# EAGLE design storage board (EAGLE 6.4)

## Sheet 1 of 2
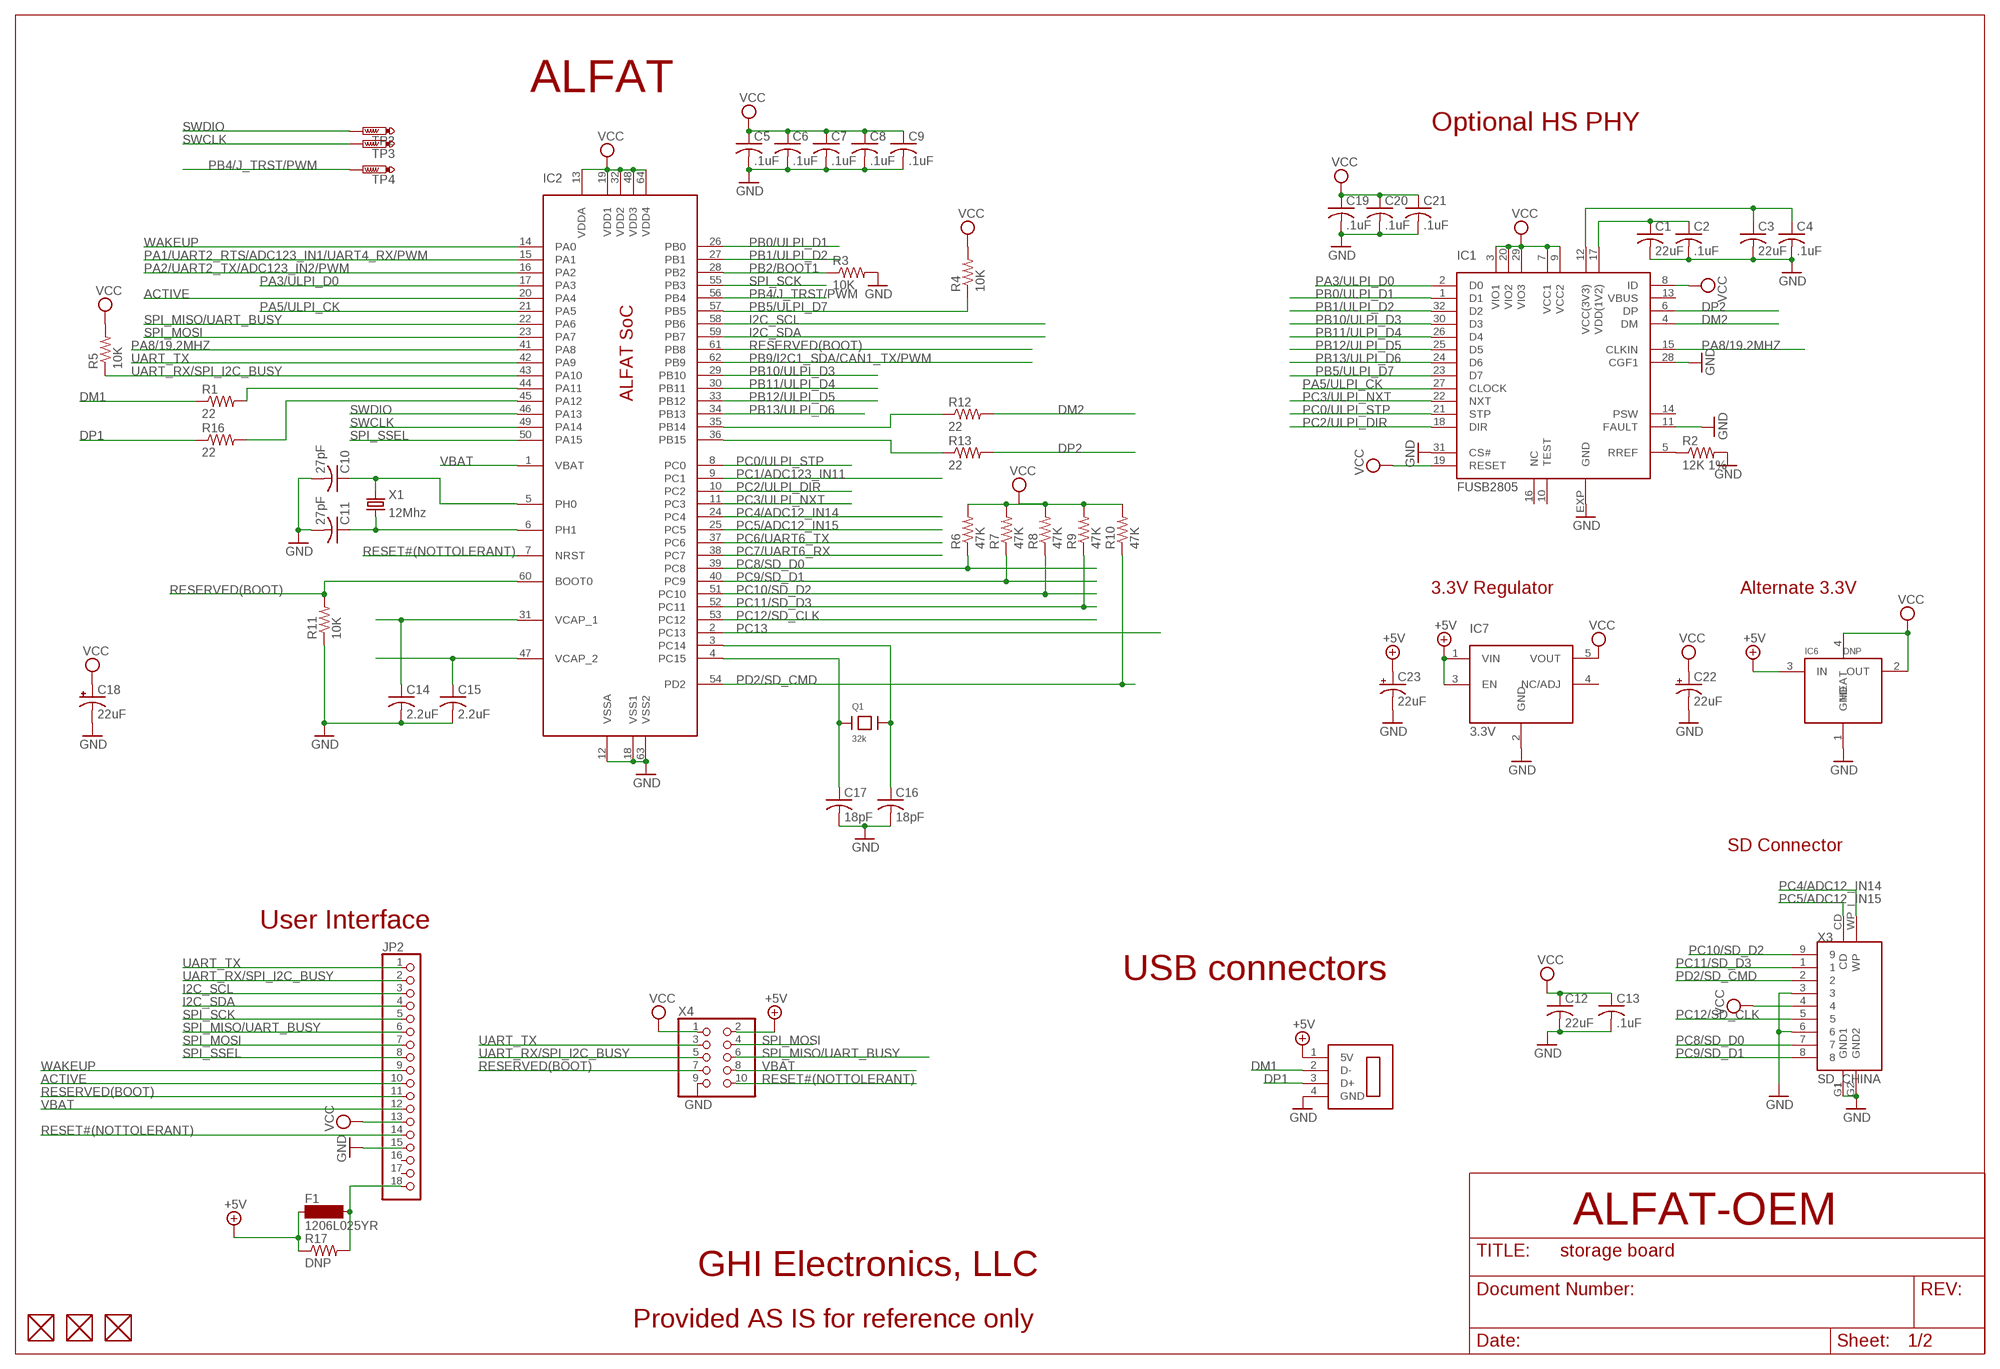
[diagram p0: schematic, sheet 1]

### Parts
C1  22uF  C-USC0805K  [C0805K]
C2  .1uF  C-USC0603K  [C0603K]
C3  22uF  C-USC0805K  [C0805K]
C4  .1uF  C-USC0603K  [C0603K]
C5  .1uF  C-USC0603K  [C0603K]
C6  .1uF  C-USC0603K  [C0603K]
C7  .1uF  C-USC0603K  [C0603K]
C8  .1uF  C-USC0603K  [C0603K]
C9  .1uF  C-USC0603K  [C0603K]
C10  27pF  C-USC0603K  [C0603K]
C11  27pF  C-USC0603K  [C0603K]
C12  22uF  C-USC0805K  [C0805K]
C13  .1uF  C-USC0603K  [C0603K]
C14  2.2uF  C-USC0805K  [C0805K]
C15  2.2uF  C-USC0805K  [C0805K]
C16  18pF  C-USC0603K  [C0603K]
C17  18pF  C-USC0603K  [C0603K]
C18  22uF  CPOL-USCT3528  [CT3528]
C19  .1uF  C-USC0603K  [C0603K]
C20  .1uF  C-USC0603K  [C0603K]
C21  .1uF  C-USC0603K  [C0603K]
C22  22uF  CPOL-USCT3528  [CT3528]
C23  22uF  CPOL-USCT3528  [CT3528]
F1  1206L025YR  SM-1206  [SM-1206]
FUD1  FIDUCIAL  [FIDUCIAL_40MIL]
FUD2  FIDUCIAL  [FIDUCIAL_40MIL]
FUD3  FIDUCIAL  [FIDUCIAL_40MIL]
IC1  FUSB2805  [MLP32]
IC2  STM32F40X  [LQFP64]
IC6  DNP  LD1117SOT89  [SOT89]
IC7  3.3V  5PIN_REG  [SOT23-5]
JP2  PINHD-1X18  [1X18]
Q1  32k  CRYSTAL_3.2X1.5  [CRYSTAL_3.2X1.5]
R1  22  R-US_R0603  [R0603]
R2  12K 1%  R-US_R0603  [R0603]
R3  10K  R-US_R0603  [R0603]
R4  10K  R-US_R0603  [R0603]
R5  10K  R-US_R0603  [R0603]
R6  47K  R-US_R0603  [R0603]
R7  47K  R-US_R0603  [R0603]
R8  47K  R-US_R0603  [R0603]
R9  47K  R-US_R0603  [R0603]
R10  47K  R-US_R0603  [R0603]
R11  10K  R-US_R0603  [R0603]
R12  22  R-US_R0603  [R0603]
R13  22  R-US_R0603  [R0603]
R16  22  R-US_R0603  [R0603]
R17  DNP  R-US_R0603  [R0603]
TP2  PTR1B1,27  [B1,27]
TP3  PTR1B1,27  [B1,27]
TP4  PTR1B1,27  [B1,27]
X1  12Mhz  CRYTALSM49  [SM49@1]
X2  USB_HOST_CON  [USB_HOST_CON]
X3  SD_CHINA  [SD_CHINA]
X4  PINHD-2X5  [2X05]

### Nets
+5V [power]: C23.+ F1.1 IC6.3(IN) IC7.1(VIN) IC7.3(EN) R17.1 X2.1(5V) X4.2
ACTIVE: IC2.20(PA4) JP2.10
DM1: R1.1 X2.2(D-)
DM2: IC1.4(DM) R12.2
DP1: R16.1 X2.3(D+)
DP2: IC1.6(DP) R13.2
GND [power]: C1.2 C2.2 C3.2 C4.2 C5.2 C6.2 C7.2 C8.2 C9.2 C10.2 C11.2 C12.2 C13.2 C14.2 C15.2 C16.2 C17.2 C18.- C19.2 C20.2 C21.2 C22.- C23.- IC1.11(FAULT) IC1.28(CGF1) IC1.31(CS#) IC1.EXP(GND) IC2.12(VSSA) IC2.18(VSS1) IC2.63(VSS2) IC6.1(GND) IC7.2(GND) JP2.15 R2.2 R3.2 R11.1 X2.4(GND) X3.3 X3.6 X3.G1(GND1) X3.G2(GND2) X4.9
I2C_SCL: IC2.58(PB6) JP2.3
I2C_SDA: IC2.59(PB7) JP2.4
N$9: C15.1 IC2.47(VCAP_2)
N$10: C14.1 IC2.31(VCAP_1)
N$12: IC1.5(RREF) R2.1
N$13: IC2.44(PA11) R1.2
N$14: C1.1 C2.1 IC1.17(VDD(1V2))
N$15: C3.1 C4.1 IC1.12(VCC(3V3))
N$16: IC2.45(PA12) R16.2
N$18: IC2.35(PB14) R12.1
N$19: IC2.36(PB15) R13.1
N$21 [power]: F1.2 JP2.18 R17.2
PA1/UART2_RTS/ADC123_IN1/UART4_RX/PWM: IC2.15(PA1)
PA2/UART2_TX/ADC123_IN2/PWM: IC2.16(PA2)
PA3/ULPI_D0: IC1.2(D0) IC2.17(PA3)
PA5/ULPI_CK: IC1.27(CLOCK) IC2.21(PA5)
PA8/19.2MHZ: IC1.15(CLKIN) IC2.41(PA8)
PB0/ULPI_D1: IC1.1(D1) IC2.26(PB0)
PB1/ULPI_D2: IC1.32(D2) IC2.27(PB1)
PB2/BOOT1: IC2.28(PB2) R3.1
PB4/J_TRST/PWM: IC2.56(PB4) TP4.PP(TP)
PB5/ULPI_D7: IC1.23(D7) IC2.57(PB5) R4.1
PB9/I2C1_SDA/CAN1_TX/PWM: IC2.62(PB9)
PB10/ULPI_D3: IC1.30(D3) IC2.29(PB10)
PB11/ULPI_D4: IC1.26(D4) IC2.30(PB11)
PB12/ULPI_D5: IC1.25(D5) IC2.33(PB12)
PB13/ULPI_D6: IC1.24(D6) IC2.34(PB13)
PC0/ULPI_STP: IC1.21(STP) IC2.8(PC0)
PC1/ADC123_IN11: IC2.9(PC1)
PC2/ULPI_DIR: IC1.18(DIR) IC2.10(PC2)
PC3/ULPI_NXT: IC1.22(NXT) IC2.11(PC3)
PC4/ADC12_IN14: IC2.24(PC4) X3.WP
PC5/ADC12_IN15: IC2.25(PC5) X3.CD
PC6/UART6_TX: IC2.37(PC6)
PC7/UART6_RX: IC2.38(PC7)
PC8/SD_D0: IC2.39(PC8) R6.1 X3.7
PC9/SD_D1: IC2.40(PC9) R7.1 X3.8
PC10/SD_D2: IC2.51(PC10) R8.1 X3.9
PC11/SD_D3: IC2.52(PC11) R9.1 X3.1
PC12/SD_CLK: IC2.53(PC12) X3.5
PC13: IC2.2(PC13)
PD2/SD_CMD: IC2.54(PD2) R10.1 X3.2
RESERVED(BOOT): IC2.60(BOOT0) IC2.61(PB8) JP2.11 R11.2 X4.7
RESET#(NOTTOLERANT): IC2.7(NRST) JP2.14 X4.10
SPI_MISO/UART_BUSY: IC2.22(PA6) JP2.6 X4.6
SPI_MOSI: IC2.23(PA7) JP2.7 X4.4
SPI_SCK: IC2.55(PB3) JP2.5
SPI_SSEL: IC2.50(PA15) JP2.8
SWCLK: IC2.49(PA14) TP3.PP(TP)
SWDIO: IC2.46(PA13) TP2.PP(TP)
UART_RX/SPI_I2C_BUSY: IC2.43(PA10) JP2.2 R5.1 X4.5
UART_TX: IC2.42(PA9) JP2.1 X4.3
VBAT: IC2.1(VBAT) JP2.12 X4.8
VCC [power]: C5.1 C6.1 C7.1 C8.1 C9.1 C12.1 C13.1 C18.+ C19.1 C20.1 C21.1 C22.+ IC1.3(VIO1) IC1.7(VCC1) IC1.8(ID) IC1.9(VCC2) IC1.19(RESET) IC1.20(VIO2) IC1.29(VIO3) IC2.13(VDDA) IC2.19(VDD1) IC2.32(VDD2) IC2.48(VDD3) IC2.64(VDD4) IC6.2(OUT) IC6.4(HEAT) IC7.5(VOUT) JP2.13 R4.2 R5.2 R6.2 R7.2 R8.2 R9.2 R10.2 X3.4 X4.1
WAKEUP: IC2.14(PA0) JP2.9
XI32: C17.1 IC2.4(PC15) Q1.P$1
XO32: C16.1 IC2.3(PC14) Q1.P$2
XTAL3: C10.1 IC2.5(PH0) X1.2
XTAL4: C11.1 IC2.6(PH1) X1.1
Unconnected: FUD1.P$1 FUD2.P$1 FUD3.P$1 IC1.10(TEST) IC1.13(VBUS) IC1.14(PSW) IC1.16(NC) IC7.4(NC/ADJ) JP2.16 JP2.17 X2.5(5V) X2.6(D-) X2.7(D+)

### Notes on the sheet
- ALFAT
- Optional HS PHY
- ALFAT SoC
- 3.3V Regulator | Alternate 3.3V
- SD Connector
- User Interface
- USB connectors
- ALFAT-OEM
- GHI Electronics, LLC
- Provided AS IS for reference only

## Sheet 2 of 2
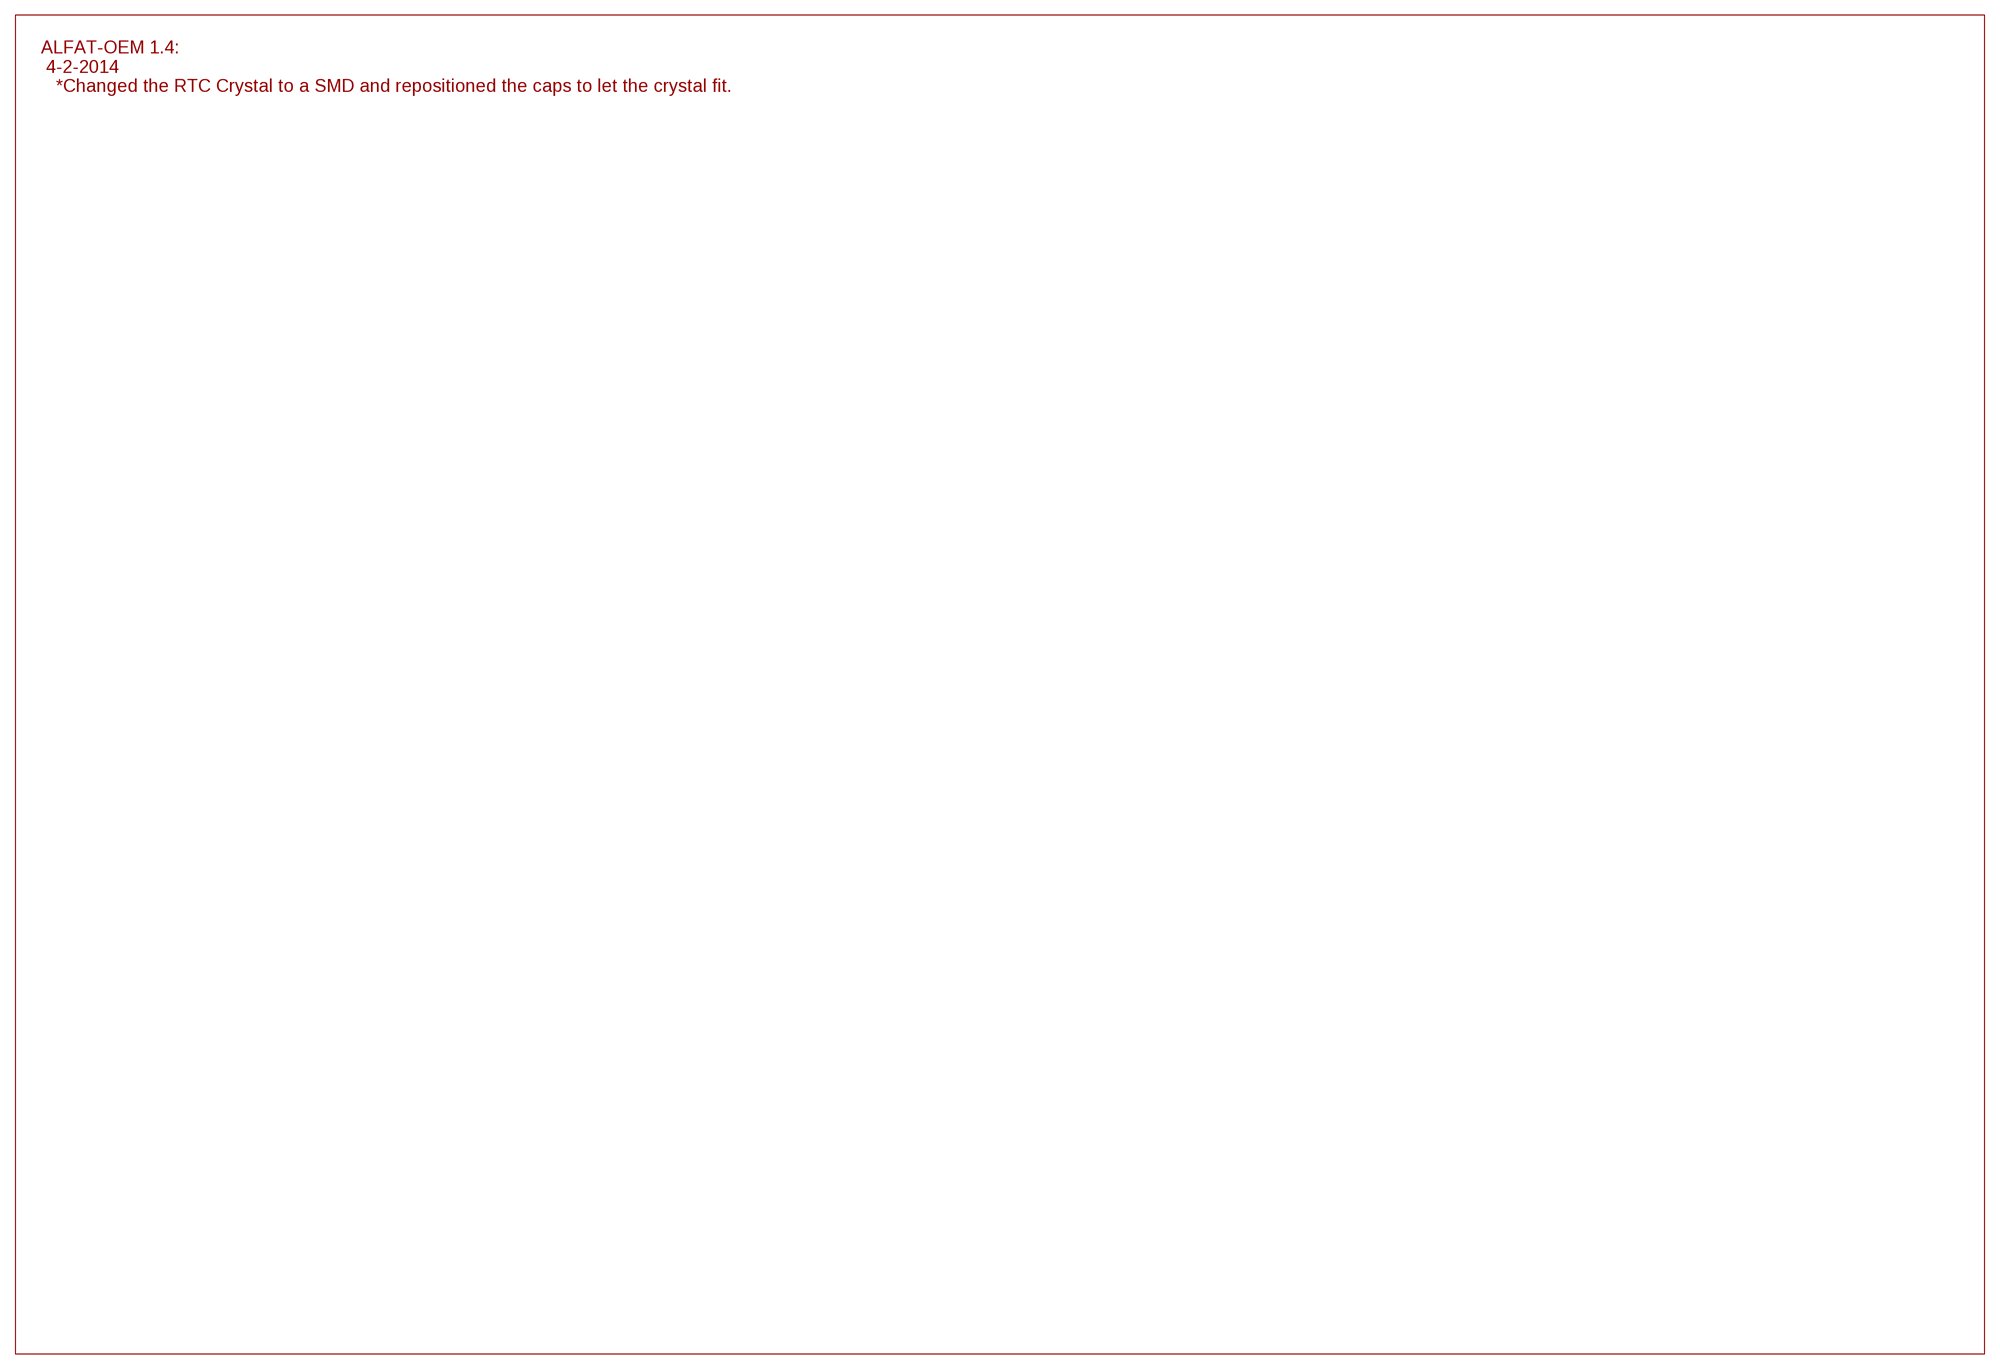
[diagram p1: schematic, sheet 2]

### Notes on the sheet
- ALFAT-OEM 1.4:
   4-2-2014
     *Changed the RTC Crystal to a SMD and repositioned the caps to let the crystal fit.

## Power pins joined to a net without a drawn wire
GND: X2.8(GND)

## Library data of the parts
C1-C17 C19-C21 = rcl:C-US: CAPACITOR, American symbol
C18 C22 C23 = rcl:CPOL-US: POLARIZED CAPACITOR, American symbol
F1 = inductor-neosid:SM-1206: INDUCTOR SMD chip inductor
FUD1-FUD3 = GHI:FIDUCIAL
IC1 = GHI:FUSB2805
IC2 = GHI:STM32F40X
IC6 = ICs_v54:LD1117
IC7 = GHI:5PIN_REG
JP2 = pinhead:PINHD-1X18: PIN HEADER
Q1 = GHI:CRYSTAL_3.2X1.5
R1-R13 R16 R17 = rcl:R-US_: RESISTOR, American symbol
TP2-TP4 = testpad:PTR1: TEST PIN
X1 = crystal:CRYTAL: CRYSTAL
X2 = GHI:USB_HOST_CON
X3 = GHI:SD_CHINA
X4 = pinhead:PINHD-2X5: PIN HEADER

## Board
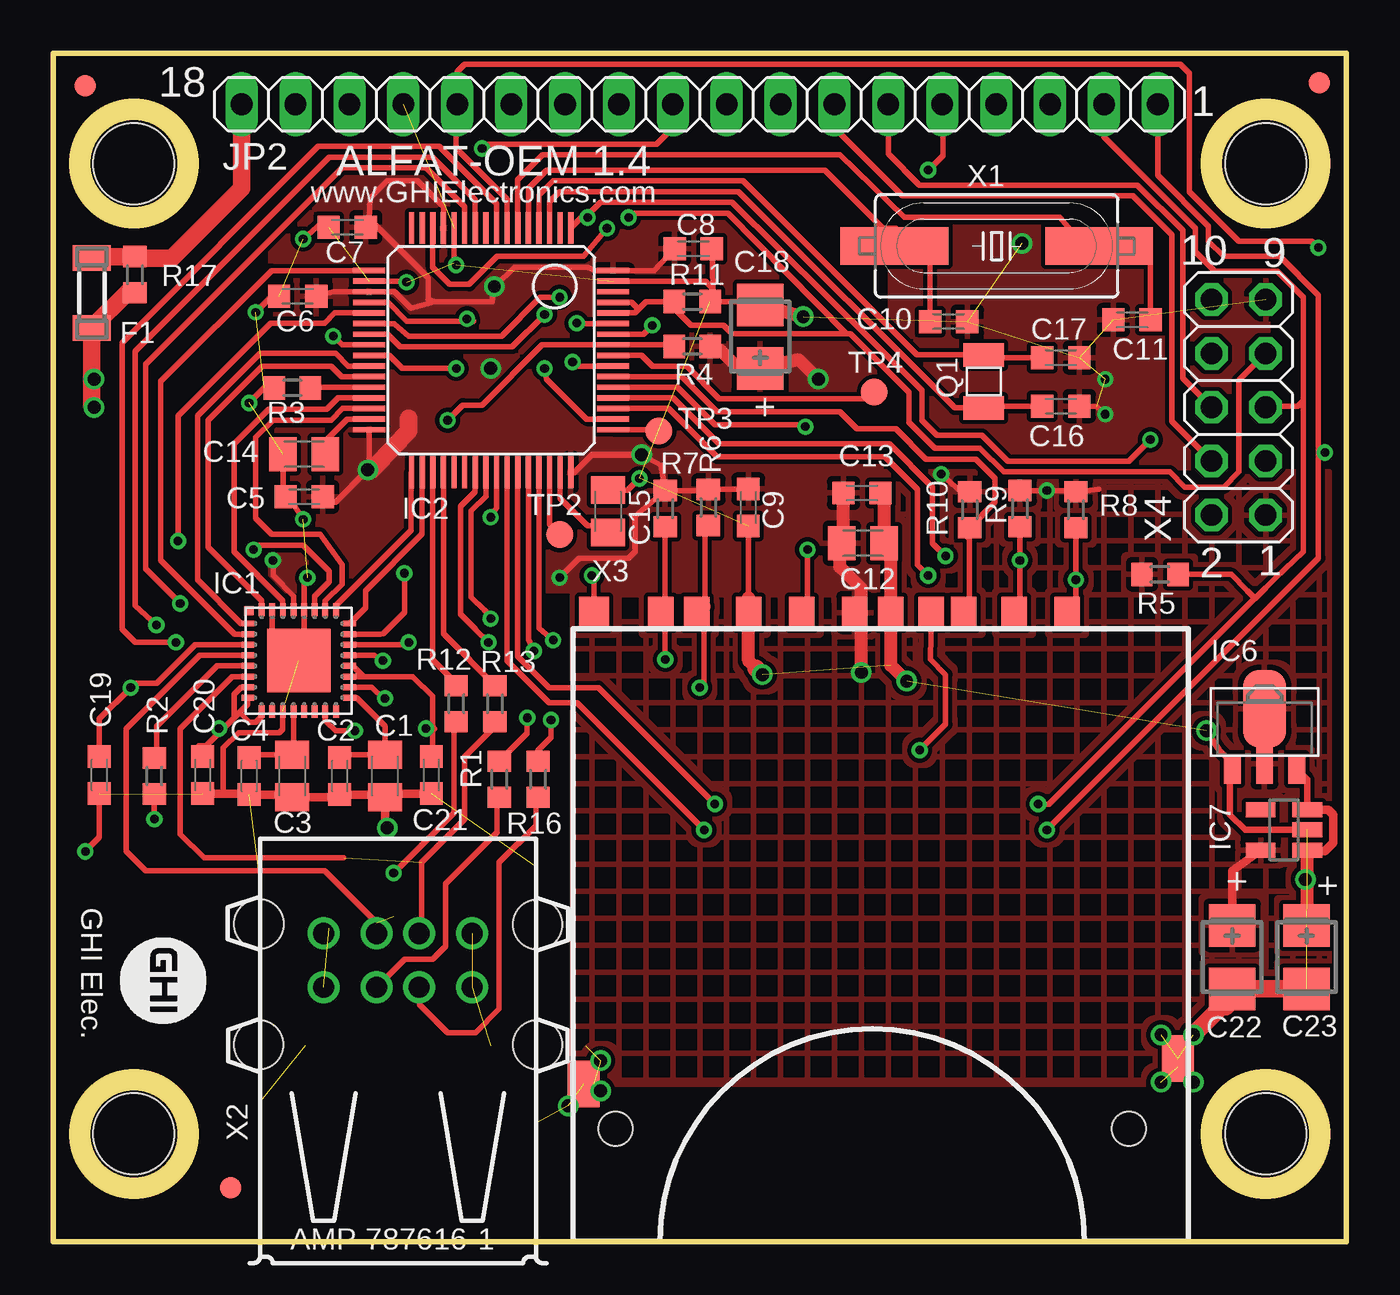
[diagram p2: board, top side]
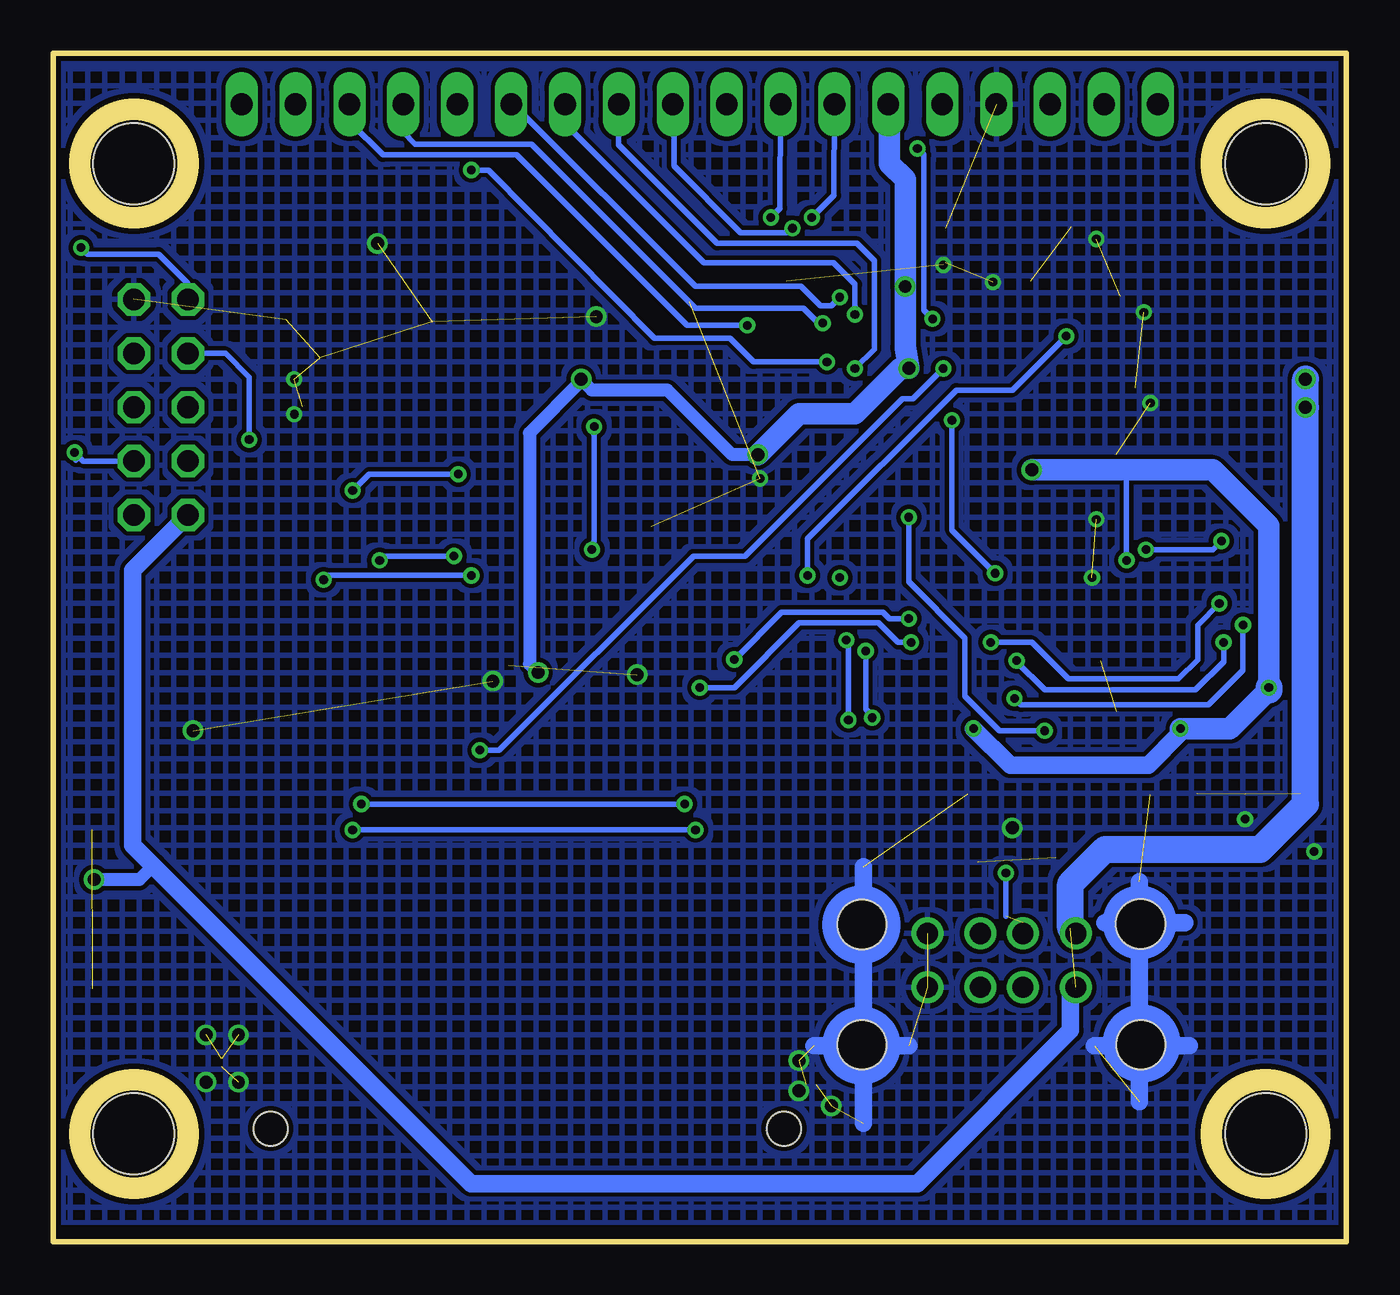
[diagram p3: board, bottom side, seen from below]

Size 60.96 x 56.01 mm. Coordinates in mm from the lower left corner, seen from the top.
Outline: 0,0 60.96,0 60.96,56.01 0,56.01 0,0
Outline: circle at 3.81,5.08 radius 2.54
Outline: circle at 57.15,5.08 radius 2.54
Outline: circle at 57.15,50.8 radius 2.54
Outline: circle at 3.81,50.8 radius 2.54
Copper layers (1*16): Top 0.035mm / dielectric 1.5mm / Bottom 0.035mm
Design rules "default": minimum track width 8mil, minimum drill 12mil, track to track 8mil, track to pad 8mil, pad to pad 8mil, via to via 8mil, smd to smd 8mil, copper to edge 10mil, drill to drill 8mil, minimum pad ring 10mil, minimum via ring 7mil, stop-mask expansion 4mil, vias tented up to drill 30mil, thermal gap 10mil
Holes 3.81 mm at 3.81,5.08 3.81,50.8 57.15,50.8 57.15,5.08

### Footprints (pad centres in the part's own frame; a part is rotated, then mirrored left to right if it is on the bottom)
C0805K = smd 1.3 x 1.6: 1 -1,0; 2 1,0
C0603K = smd 1.05 x 1.08: 1 -0.875,0; 2 0.875,0
CT3528 = smd 2 x 2.2: + -1.5,0; - 1.5,0
SM-1206 = smd 1.2 x 1.8: 1 -1.65,0; 2 1.65,0
FIDUCIAL_40MIL = smd 1.016 x 1.016: P$1 0,0
MLP32 = smd 0.6 x 0.28: 1 -2.4,1.75; 2 -2.4,1.25; 3 -2.4,0.75; 4 -2.4,0.25; 5 -2.4,-0.25; 6 -2.4,-0.75; 7 -2.4,-1.25; 8 -2.4,-1.75; 17 2.4,-1.75; 18 2.4,-1.25; 19 2.4,-0.75; 20 2.4,-0.25; 21 2.4,0.25; 22 2.4,0.75; 23 2.4,1.25; 24 2.4,1.75 | smd 0.28 x 0.6: 9 -1.75,-2.4; 10 -1.25,-2.4; 11 -0.75,-2.4; 12 -0.25,-2.4; 13 0.25,-2.4; 14 0.75,-2.4; 15 1.25,-2.4; 16 1.75,-2.4; 25 1.75,2.4; 26 1.25,2.4; 27 0.75,2.4; 28 0.25,2.4; 29 -0.25,2.4; 30 -0.75,2.4; 31 -1.25,2.4; 32 -1.75,2.4 | smd 3 x 3: EXP 0,0 | smd 0.435 x 0.435: M -2.353,2.353
LQFP64 = smd 0.25 x 1.5: 1 -3.75,-5.75; 2 -3.25,-5.75; 3 -2.75,-5.75; 4 -2.25,-5.75; 5 -1.75,-5.75; 6 -1.25,-5.75; 7 -0.75,-5.75; 8 -0.25,-5.75; 9 0.25,-5.75; 10 0.75,-5.75; 11 1.25,-5.75; 12 1.75,-5.75; 13 2.25,-5.75; 14 2.75,-5.75; 15 3.25,-5.75; 16 3.75,-5.75; 33 3.75,5.75; 34 3.25,5.75; 35 2.75,5.75; 36 2.25,5.75; 37 1.75,5.75; 38 1.25,5.75; 39 0.75,5.75; 40 0.25,5.75; 41 -0.25,5.75; 42 -0.75,5.75; 43 -1.25,5.75; 44 -1.75,5.75; 45 -2.25,5.75; 46 -2.75,5.75; 47 -3.25,5.75; 48 -3.75,5.75 | smd 1.5 x 0.25: 17 5.75,-3.75; 18 5.75,-3.25; 19 5.75,-2.75; 20 5.75,-2.25; 21 5.75,-1.75; 22 5.75,-1.25; 23 5.75,-0.75; 24 5.75,-0.25; 25 5.75,0.25; 26 5.75,0.75; 27 5.75,1.25; 28 5.75,1.75; 29 5.75,2.25; 30 5.75,2.75; 31 5.75,3.25; 32 5.75,3.75; 49 -5.75,3.75; 50 -5.75,3.25; 51 -5.75,2.75; 52 -5.75,2.25; 53 -5.75,1.75; 54 -5.75,1.25; 55 -5.75,0.75; 56 -5.75,0.25; 57 -5.75,-0.25; 58 -5.75,-0.75; 59 -5.75,-1.25; 60 -5.75,-1.75; 61 -5.75,-2.25; 62 -5.75,-2.75; 63 -5.75,-3.25; 64 -5.75,-3.75
SOT89 = smd 0.8 x 1.4: 1 -1.524,-1.905; 3 1.524,-1.905 | smd 0.8 x 1.9: 2 0,-1.651 | smd 2.032 x 3.65: 4 0,0.94
SOT23-5 = smd 0.7 x 1.4: 1 0.95,1.1; 2 0,1.1; 3 -0.95,1.1; 4 -0.95,-1.1; 5 0.95,-1.1
1X18 = drill 1.016 long: 1 -21.59,0; 2 -19.05,0; 3 -16.51,0; 4 -13.97,0; 5 -11.43,0; 6 -8.89,0; 7 -6.35,0; 8 -3.81,0; 9 -1.27,0; 10 1.27,0; 11 3.81,0; 12 6.35,0; 13 8.89,0; 14 11.43,0; 15 13.97,0; 16 16.51,0; 17 19.05,0; 18 21.59,0
CRYSTAL_3.2X1.5 = smd 1.1 x 1.9: P$1 -1.2,0; P$2 1.3,0
R0603 = smd 1 x 1.1: 1 -0.85,0; 2 0.85,0
B1,27 = smd 1.27 x 1.27: PP 0,0
SM49@1 = smd 5.08 x 1.778: 1 -4.826,0; 2 4.826,0
USB_HOST_CON = drill 1: 1 -3.5,5.37; 2 -1,5.37; 3 1,5.37; 4 3.5,5.37; 5 -3.5,7.91; 6 -1,7.91; 7 1,7.91; 8 3.5,7.91 | hole 2.3: -6.57,2.66; 6.57,2.66 | hole 2.311: -6.553,8.357; 6.579,8.331
SD_CHINA = smd 1.2 x 1.5: 1 6.68,24.31; 2 4.307,24.31; 3 0.88,24.31; 4 -0.83,24.31; 5 -3.33,24.31; 6 -5.83,24.31; 7 -8.26,24.31; 8 -9.96,24.31; 9 9.18,24.31; CD 2.784,24.31 | smd 1.5 x 2.2: G1 -13.6,2.1; G2 14.4,3.3 | smd 1.4 x 1.5: WP -13.11,24.31 | hole 1.6: -12.1,0; 12.1,0
2X05 = drill 1.016 octagon: 1 -5.08,-1.27; 2 -5.08,1.27; 3 -2.54,-1.27; 4 -2.54,1.27; 5 0,-1.27; 6 0,1.27; 7 2.54,-1.27; 8 2.54,1.27; 9 5.08,-1.27; 10 5.08,1.27

### Placement (x,y rotation side)
C1  15.65,21.95 270 top
C2  13.51,21.95 270 top
C3  11.28,21.95 270 top
C4  9.25,21.95 270 top
C5  11.84,35.1 180 top
C6  11.53,44.55 180 top
C7  13.87,47.8 180 top
C8  30.18,46.79 0 top
C9  32.77,34.59 270 top
C10  42.21,43.36 0 top
C11  50.85,43.43 180 top
C12  38.18,32.92 0 top
C13  38.13,35.28 0 top
C14  11.84,37.11 180 top
C15  26.16,34.42 90 top
C16  47.5,39.37 0 top
C17  47.5,41.66 0 top
C18  33.32,42.65 90 top
C19  2.18,22 270 top
C20  7.06,22 270 top
C21  17.83,22 270 top
C22  55.58,13.41 270 top
C23  59.08,13.41 270 top
F1  1.83,44.7 90 top
FUD1  8.38,2.54 0 top
FUD2  1.52,54.46 0 top
FUD3  59.69,54.61 0 top
IC1  11.58,27.38 0 top
IC2  20.65,42.01 180 top
IC6  57.1,24.18 0 top
IC7  58.01,19.41 270 top
JP2  30.48,53.59 180 top
Q1  43.87,40.59 270 top
R1  21.03,21.79 90 top
R2  4.78,21.95 270 top
R3  11.28,40.23 180 top
R4  30.12,42.19 0 top
R5  52.17,31.45 180 top
R6  30.89,34.59 90 top
R7  28.85,34.54 90 top
R8  48.21,34.49 90 top
R9  45.57,34.54 90 top
R10  43.21,34.49 90 top
R11  30.12,44.3 180 top
R12  19,25.35 270 top
R13  20.83,25.35 270 top
R16  22.86,21.79 90 top
R17  3.86,45.57 90 top
TP2  23.88,33.32 0 top
TP3  28.55,38.2 0 top
TP4  38.71,40.03 0 top
X1  44.48,46.91 180 top
X2  16.26,6.62 0 top
X3  38.61,5.33 0 top
X4  55.88,39.32 90 top

### Tracks (layer width: path | path; a pad name or v marks a point on that pad's centre or on a via)
+5V  (via drill 0.61)  (1 unrouted)
  Top 0.305: IC7.3 59.11,21.79 IC6.3
  Top 0.406: IC7.3 60.11,20.36 60.35,20.12 60.35,18.8 59.94,18.39 59.18,18.39 IC7.1
  Top 0.61: C23.+ 59.08,17.02 v59.03,17.07 59.11,17.15 IC7.1
  Top 0.813: R17.1 3.49,44.72 F1.1 1.83,39.42 v1.93,39.32
  Bottom 0.61: v59.03,17.07 56.9,17.07 56.24,17.73
  Bottom 0.813: X2.1 13.01,11.74 13.01,9.96 20.22,2.74 41.25,2.74 56.24,17.73 57.2,18.69 57.2,31.65 X4.2
  Bottom 1.27: v1.93,40.64 v1.93,39.32 1.93,20.62 4.06,18.49 11.38,18.49 13.01,16.87 13.01,14.78
ACTIVE  (via drill 0.41)
  Top 0.254: IC2.20 15.78,44.26 16.66,43.38 19.81,43.38 v19.51,43.48 | v20.22,51.51 20.32,51.51 20.52,51.71 28.45,51.71 29.26,52.53 29.26,53.54 JP2.10
  Bottom 0.254: v19.51,43.48 19.91,43.89 19.91,51.21 v20.22,51.51
DM1
  Top 0.254: X2.2 16.58,13.31 17.88,13.31 18.49,13.92 18.49,16.87 20.93,19.3 20.93,20.84 R1.1
DM2  (via drill 0.41)  (1 unrouted)
  Top 0.254: IC1.4 6.91,27.63 3.45,24.18 3.45,18.39 4.37,17.48 12.8,17.48 15.24,15.04 15.24,14.55 | R12.2 19.09,24.6 18.9,24.79 18.9,20.22 v16.05,17.37
  Bottom 0.254: 16.05,15.33 v16.05,17.37
DP1
  Top 0.254: X2.3 17.27,11.18 18.59,9.86 19.91,9.86 21.03,10.97 21.03,17.88 22.76,19.61 22.76,20.84 R16.1
DP2  (1 unrouted)
  Top 0.254: IC1.6 8.45,26.63 5.99,24.18 5.99,19.2 7.11,18.09 13.7,18.09 | R13.2 21.23,24.69 19.41,22.86 19.41,19.91 17.37,17.88 17.37,14.65
GND  (via drill 0.41, 0.61)  (35 unrouted)
  Top 0.254: R3.2 9.96,40.23 v9.25,39.52 | 10.84,35.49 C14.2 | 10.84,35.49 v11.79,34.04 | C16.2 49.2,39.34 v49.59,38.99 | C6.2 10.21,44.45 v9.55,43.79 | IC2.18 16.61,45.26 v16.66,45.21 | IC2.12 18.9,46.12 v19,46.02 | C7.2 12.65,48.01 v11.79,47.24 | 10.84,35.49 10.84,34.82 C5.2 | IC1.31 10.33,28.63 IC1.EXP | 31.11,44.91 31.1,44.42 R11.1 32.97,44.3 C18.- | 31.11,44.91 C8.2 | C19.2 2.18,19.05 v1.52,18.39 | v4.78,19.91 R2.2 | IC1.11 10.83,24.14 10.67,23.98 8.74,23.98 8.03,23.27 8.03,21.12 | IC2.63 30.76,45.26 31.11,44.91 | C15.2 27.09,35.42 v27.64,35.97 | 32.77,30.34 C9.2 | X3.G1 25.48,7.43 v25.81,7.11 | X3.G2 53.01,8.26 v53.75,7.52 | v11.99,31.29 11.83,31.14 IC1.28 11.83,28.6
  Top 0.305: 11.83,28.6 11.89,28.55 11.89,27.84 11.58,27.53 | IC7.2 56.19,19.41 55.47,20.12 55.47,22.17 | 55.47,22.17 55.47,22.66 54.97,23.16 v54.36,24.08 | 55.47,22.17 IC6.1
  Top 0.406: C20.2 8.03,21.12 9.2,21.12 C4.2 11.15,21.07 C3.2 13.39,20.95 C2.2 15.52,21.07 C1.2 | C1.2 15.65,19.61 v15.75,19.51 | C21.2 15.82,21.12 C1.2 | IC1.EXP 11.58,27.53
  Top 0.61: C18.- 34.09,43.94 v35.36,43.59 | v40.23,26.42 39.49,27.16 X3.3 39.49,32.61 C12.2 39.18,35.1 C13.2 | v33.43,26.72 32.78,27.37 X3.6 32.78,30.33 32.77,30.34
  Top 0.813: v40.23,26.42 40.23,26.51 | v33.43,26.72 33.13,27.02 | C23.- 56.11,11.91 55.27,11.07 55.27,11.61 C22.- 55.58,11.58 v53.75,9.75
  Bottom 0.813: 7.42,9.25 11.89,9.25 | 9.75,6.6 9.75,16.97 | 20.62,9.25 25.09,9.25 | 22.76,5.59 22.76,17.68
  other vias: 49.59,40.64 45.67,47.04 52.22,7.52 52.22,9.75 25.81,8.53 24.28,6.4
  pour Bottom (hatched): 61.16,55.68 0.1,55.68 0.1,0.91 61.16,0.91
  pour Top: 39.52,51.31 39.42,36.47 57.2,36.47 57.3,51.31
I2C_SCL  (via drill 0.41)
  Top 0.254: IC2.58 27.83,42.76 v28.25,43.18
  Bottom 0.254: v28.25,43.18 31.09,43.18 39.12,51.21 45.41,51.21 46.94,52.73 46.94,53.73 JP2.3
I2C_SDA  (via drill 0.41)
  Top 0.254: IC2.59 24.71,43.26 v24.69,43.28
  Bottom 0.254: JP2.4 44.47,52.29 43.89,51.71 38.41,51.71 30.68,43.99 25.6,43.99 24.89,43.28 v24.69,43.28
N$9
  Top 0.254: IC2.47 23.9,35.03 25.2,33.73 25.85,33.73 C15.1
N$10
  Top 0.254: IC2.31 13.87,38.76 12.9,37.8 12.9,36.87 C14.1
N$12
  Top 0.254: IC1.5 7.73,27.13 4.88,24.28 4.88,22.9 R2.1
N$13  (via drill 0.41)
  Top 0.254: IC2.44 22.4,28.39 v22.66,27.84 | v22.35,24.69 22.35,23.96 R1.2
  Bottom 0.254: v22.35,24.69 22.35,24.79 22.66,25.09 v22.66,27.84
N$14
  Top 0.254: IC1.17 14.3,25.63 15.65,24.28 C1.1 13.64,22.95 C2.1
N$15
  Top 0.254: IC1.12 11.33,23 C3.1 9.37,22.95 C4.1
N$16  (via drill 0.41)
  Top 0.254: 22.9,23.11 R16.2 22.86,23.16 23.47,23.77 v23.47,24.59 | IC2.45 22.9,28.92 v23.57,28.35
  Bottom 0.254: v23.47,24.59 23.47,28.14 23.57,28.25 v23.57,28.35
N$18
  Top 0.254: R12.1 19.1,26.21 17.9,27.41 IC2.35
N$19
  Top 0.254: R13.1 20.93,26.11 18.4,28.64 IC2.36
N$21
  Top 0.813: JP2.18 8.89,49.63 5.59,46.33 3.95,46.33 R17.2 1.89,46.42 F1.2
N$27
  Bottom 0.813: 7.62,15.04 11.38,15.04
PA3/ULPI_D0
  Top 0.254: IC2.17 10.3,45.76 5.08,40.54 5.08,32.11 8.55,28.63 IC1.2
PA5/ULPI_CK  (via drill 0.41)
  Top 0.254: v5.89,33.02 5.89,38.91 10.26,43.28 12.8,43.28 13.28,43.76 IC2.21 | IC1.27 12.33,30.42 13.01,31.09 13.01,31.6 11.79,32.82 9.45,32.82 v9.45,32.61
  Bottom 0.254: v9.45,32.61 6.3,32.61 v5.89,33.02
PA8/19.2MHZ  (via drill 0.41)
  Top 0.254: IC2.41 20.9,34.57 v20.62,34.14 | v14.22,24.08 13.31,24.08 12.83,24.56 IC1.15
  Bottom 0.254: v20.62,34.14 20.62,31.09 17.98,28.45 17.98,25.7 16.36,24.08 v14.22,24.08
PB0/ULPI_D1
  Top 0.254: IC2.26 13.91,41.26 13.31,41.86 9.75,41.86 6.81,38.91 6.81,31.19 8.87,29.13 IC1.1
PB1/ULPI_D2
  Top 0.254: IC2.27 13.59,40.76 13.11,41.25 9.86,41.25 7.32,38.71 7.32,32.72 9.83,30.2 IC1.32
PB2/BOOT1
  Top 0.254: IC2.28 12.16,40.26 R3.1
PB4/J_TRST/PWM
  Top 0.254: IC2.56 27.73,41.76 28.25,41.25 29.87,41.25 31.39,39.73 38.41,39.73 TP4.PP
PB5/ULPI_D7  (via drill 0.41)
  Top 0.254: R4.1 28.9,42.26 IC2.57 23.06,42.26 20.22,39.42 19.3,39.42 v18.59,38.71 | IC1.23 15.42,28.63 15.54,28.65 16.56,29.67 v16.56,31.5
  Bottom 0.254: v18.59,38.71 18.59,33.53 v16.56,31.5
PB10/ULPI_D3
  Top 0.254: IC2.29 13.45,39.76 12.9,39.22 10.16,39.22 8.53,37.59 8.53,32.51 10.83,30.21 IC1.30
PB11/ULPI_D4
  Top 0.254: IC2.30 13.66,39.26 13.11,38.71 10.36,38.71 9.55,37.9 9.55,34.09 10.31,33.33 12.6,33.33 13.61,31.9 13.61,30.99 12.83,30.21 IC1.26
PB12/ULPI_D5
  Top 0.254: IC1.25 13.33,30 16.87,33.53 16.87,36.23 IC2.33
PB13/ULPI_D6
  Top 0.254: IC2.34 17.4,33.35 14.73,30.68 14.73,29.88 IC1.24
PC0/ULPI_STP  (via drill 0.41)
  Top 0.254: IC2.8 20.9,48.9 18.19,51.61 12.5,51.61 3.25,42.37 3.25,28.85 3.86,28.25 v5.79,28.25 | IC1.21 15.14,27.63 v15.54,27.38
  Bottom 0.254: v5.79,28.25 5.79,27.33 7.11,26.01 14.22,26.01 15.54,27.33 v15.54,27.38
PC2/ULPI_DIR  (via drill 0.41)
  Top 0.254: IC2.10 19.9,49.09 17.88,51.1 13.01,51.1 3.86,41.96 3.86,29.97 v4.88,29.06 | IC1.18 15.02,26.13 15.54,25.6 v15.65,25.6
  Bottom 0.254: v4.88,29.06 4.88,26.92 6.5,25.3 15.34,25.3 v15.65,25.6
PC3/ULPI_NXT  (via drill 0.41)
  Top 0.254: IC2.11 19.4,48.77 17.58,50.6 13.61,50.6 13.41,50.39 4.37,41.35 4.37,31.7 v5.99,30.07 | v16.76,28.25 16.65,28.13 IC1.22
  Bottom 0.254: v16.76,28.25 14.83,28.25 13.11,26.52 7.92,26.52 7.01,27.43 7.01,29.06 v5.99,30.07
PC4/ADC12_IN14  (via drill 0.41)
  Top 0.254: X3.WP 25.5,31.3 v25.4,31.39 | IC2.24 13.62,42.26 v13.21,42.67
  Bottom 0.254: v25.4,31.39 25.4,33.12 18.39,40.13 15.75,40.13 v13.21,42.67
PC5/ADC12_IN15  (via drill 0.41)
  Top 0.254: X3.CD 41.34,27.44 42.06,26.72 42.06,24.38 v40.84,23.16 | IC2.25 15.85,41.76 16.46,41.15 18.79,41.15 v19,41.15
  Bottom 0.254: v40.84,23.16 39.93,23.16 30.79,32.31 28.35,32.31 20.93,39.73 20.42,39.73 v19,41.15
PC8/SD_D0  (via drill 0.41)
  Top 0.254: R6.1 30.73,33.69 30.73,30.03 X3.7 | v30.48,26.11 30.48,26.21 30.68,26.11 30.68,29.93 | IC2.39 19.9,35.34 19.2,34.65 19.2,29.57 19.91,28.85 19.9,28.87 v20.52,28.25
  Top 0.61: 30.68,29.93 30.63,29.93 X3.7
  Bottom 0.254: v30.48,26.11 28.85,26.11 25.81,29.16 22.05,29.16 21.13,28.25 v20.52,28.25
PC9/SD_D1  (via drill 0.41)
  Top 0.254: v28.85,27.43 28.85,29.87 28.85,29.95 | R7.1 28.83,33.51 28.83,29.83 X3.8 | IC2.40 20.4,35.13 19.71,34.44 19.71,30.38 20.32,29.77 20.4,29.69 v20.62,29.36
  Top 0.61: 28.83,29.83 28.83,29.85 28.85,29.87
  Bottom 0.254: v20.62,29.36 21.54,29.36 21.84,29.67 26.62,29.67 v28.85,27.43
PC10/SD_D2  (via drill 0.41)
  Top 0.254: R8.1 v48.21,31.19 48.21,30.05 48.2,30.05 X3.9 | IC2.51 29.01,39.26 31.29,36.98 39.22,36.98 40.74,35.46 40.74,31.9 v41.25,31.39
  Bottom 0.254: v41.25,31.39 48.01,31.39 v48.21,31.19
PC11/SD_D3  (via drill 0.41)
  Top 0.254: IC2.52 29.23,39.76 31.39,37.59 39.42,37.59 41.45,35.56 41.45,32.92 v42.06,32.31 | R9.1 v45.57,32.11 45.57,29.92 X3.1
  Bottom 0.254: v42.06,32.31 45.36,32.31 v45.57,32.11
PC12/SD_CLK  (via drill 0.41)
  Top 0.254: IC2.53 29.44,40.26 31.19,38.51 35.56,38.51 v35.46,38.41 | v35.56,32.61 35.56,29.93 X3.5
  Bottom 0.254: v35.46,38.41 35.46,32.72 v35.56,32.61
PD2/SD_CMD
  Top 0.254: IC2.54 29.65,40.76 31.29,39.12 37.08,39.12 37.9,38.3 39.73,38.3 41.15,36.88 43.48,36.88 44.4,35.97 44.4,34.84 R10.1 43.2,33.55 42.98,33.33 43.18,33.12 43.18,30.02 43.17,30.02 X3.2
RESERVED(BOOT)  (via drill 0.41)
  Top 0.254: IC2.60 27.42,43.76 27.42,43.77 27.58,43.94 | 27.58,43.94 27.94,44.3 R11.2 29.27,43.98 30.07,43.18 31.6,43.18 32,42.77 37.39,42.77 | v27.13,48.26 27.33,48.46 31.8,48.46 37.39,42.77 | 37.39,42.77 37.59,42.77 40.34,40.03 40.34,38.61 41.55,37.39 43.69,37.39 44.81,36.27 52.63,36.27 53.34,35.56 55.17,35.56 55.88,36.27 55.88,40.59 X4.7 | IC2.61 27.27,44.26 27.58,43.94
  Bottom 0.254: JP2.11 26.69,48.7 v27.13,48.26
RESET#(NOTTOLERANT)  (via drill 0.41)
  Top 0.254: IC2.7 21.4,49.11 19,51.51 19,53.54 JP2.14 19.05,55.12 19.41,55.47 53.14,55.47 53.54,55.07 53.54,49.48 55.88,47.14 59.33,47.14 v59.64,46.84
  Bottom 0.254: X4.10 54.61,45.16 55.98,46.53 59.33,46.53 v59.64,46.84
SPI_MISO/UART_BUSY  (via drill 0.41)
  Top 0.254: v23.88,44.5 22.96,44.5 21.13,42.67 16.76,42.67 16.07,43.26 IC2.22 | JP2.6 39.37,51.26 40.84,49.78 51.1,49.78 53.24,47.65 53.24,40.69 X4.6
  Bottom 0.254: JP2.6 39.39,53.72 30.68,45.01 25.7,45.01 24.79,44.09 24.28,44.09 v23.88,44.5
SPI_MOSI  (via drill 0.41)
  Top 0.254: IC2.23 15.76,42.76 16.36,42.16 21.64,42.16 v23.16,43.69 | JP2.7 36.83,52.48 40.03,49.28 50.9,49.28 52.73,47.45 52.73,38.66 X4.4
  Bottom 0.254: v23.16,43.69 23.16,45.11 24.18,46.13 30.28,46.13 36.85,52.7 36.85,53.57 JP2.7
SPI_SCK  (via drill 0.41)
  Top 0.254: JP2.5 41.93,51.18 v41.25,50.49 | IC2.55 24.68,41.26 v24.49,41.45
  Bottom 0.254: v41.25,50.49 40.44,50.49 32.61,42.57 29.06,42.57 27.94,41.45 v24.49,41.45
SPI_SSEL  (via drill 0.41)
  Top 0.254: IC2.50 25.14,38.76 23.27,40.64 v23.16,41.15
  Bottom 0.254: JP2.8 34.31,51.68 29.67,47.04 23.06,47.04 22.25,46.23 22.25,42.06 v23.16,41.15
SWCLK
  Top 0.254: IC2.49 28.3,38.26 TP3.PP
SWDIO
  Top 0.254: IC2.46 23.4,33.8 TP2.PP
UART_RX/SPI_I2C_BUSY  (via drill 0.41)
  Top 0.254: JP2.2 49.53,52.07 53.85,47.75 53.85,46.63 54.76,45.72 57.71,45.72 58.93,44.5 58.93,39.62 | 58.93,39.62 58.93,32.51 57.63,31.28 | v46.43,20.62 46.94,20.62 56.69,30.38 57.63,31.28 | v31.19,20.62 25.7,26.11 23.37,26.11 21.95,27.53 21.9,27.59 IC2.43 | R5.1 55.52,31.45 56.29,30.68 56.34,30.63 56.64,30.33 56.68,30.33 57.63,31.28 | 58.93,39.62 58.67,39.37 57.2,39.37 X4.5
  Bottom 0.254: v31.19,20.62 v46.43,20.62
UART_TX  (via drill 0.41)
  Top 0.254: JP2.1 52.07,50.24 54.46,47.85 54.46,47.14 55.17,46.43 57.81,46.43 59.64,44.6 59.64,37.19 | 59.64,37.19 59.64,32.21 v46.84,19.41 | IC2.42 21.4,27.37 23.37,25.4 24.69,25.4 v30.68,19.41 | 59.64,37.19 v59.94,37.19
  Bottom 0.254: v30.68,19.41 v46.84,19.41 | 59.89,36.83 v59.94,37.19 59.54,36.78 X4.3
VBAT  (via drill 0.41)
  Top 0.254: IC2.1 24.9,48.26 v25.2,48.26 25.2,48.36 25.81,48.97 32,48.97 40.95,40.13 40.95,38.71 41.66,38 43.79,38 45.01,36.78 50.7,36.78 v51.71,37.8
  Bottom 0.254: JP2.12 24.15,49.31 v25.2,48.26 | X4.8 52.83,41.86 51.71,40.74 v51.71,37.8
VCC  (via drill 0.41, 0.61)
  Top 0.254: C6.1 13.23,44.76 IC2.19 16.1,44.76 16.87,43.99 17.98,44.3 | IC2.13 18.4,48.76 17.17,49.99 15.75,49.99 14.94,49.17 14.9,48.16 C7.1 15.09,48.01 17.68,45.41 17.68,44.4 17.98,44.3 | IC2.32 14.9,36.44 v14.83,36.37 13.31,34.85 12.86,34.85 C5.1 | C8.1 28.33,45.76 IC2.64 25.56,45.76 25.2,45.92 21.74,45.92 20.83,45.01 20.84,45.05 v20.8,45.01 20.7,44.3 17.98,44.3 | IC1.8 9.18,25.34 8.79,24.94 | 7.92,24.08 7.21,23.37 6.87,23.37 C20.1 | 7.92,24.08 8.53,24.69 | 8.53,24.69 8.79,24.94 | IC1.9 9.83,24.77 9.55,24.49 9.25,24.49 8.79,24.94 | IC1.7 8.86,26.13 8.53,25.81 8.53,24.69 | v7.82,24.18 7.92,24.08 | IC1.29 11.33,30.43 10.36,31.39 v10.36,32.11 | R7.2 28.65,36.58 v27.74,37.08 | R7.2 30.73,35.39 R6.2 32.74,35.45 C9.1 | 49.29,35.45 R8.2 48.16,35.39 v46.84,35.39 R9.2 | R10.2 42.8,35.33 v41.86,36.17 | IC1.3 6.69,28.13 4.88,26.31 3.86,26.31 v3.66,26.11 2.18,24.64 C19.1 | 14.63,26.63 IC1.19 | 14.63,26.63 16.95,26.63 17.88,25.7 17.88,24.28 | 17.88,24.28 17.88,22.92 C21.1 | IC1.20 14.13,27.13 14.63,26.63 | v17.58,24.18 17.98,24.18 17.88,24.28 | v23.88,31.29 24.79,32.21 27.13,32.21 27.43,32.51 27.43,34.17 R7.2 | X3.4 37.98,29.64 38.1,29.77
  Top 0.305: IC2.48 24.58,36.26 25.4,37.08 v27.74,37.08
  Top 0.406: v14.83,36.37 15.04,36.37 | IC7.5 55.58,17.49 C22.+
  Top 0.61: 35.97,40.54 v36.07,40.64 35.16,41.55 C18.+ 33.02,41.25 32.21,41.25 31.47,41.99 R4.2 | v38.1,26.82 38.1,29.77 38.1,30.79 37.08,31.8 37.08,32.83 C12.1 37.25,32.99 C13.1
  Top 0.813: 15.04,36.37 16.56,38 16.76,38.2 16.76,38.81
  Bottom 0.254: v41.86,36.17 46.06,36.17 v46.84,35.39 | v10.36,32.11 10.36,36.27 10.26,36.37 | 3.66,26.01 3.66,25.91
  Bottom 0.61: v38.1,26.82 38.51,27.23 38.51,38.1 36.07,40.54 v36.07,40.64 35.56,40.13 32,40.13 28.96,37.08 v27.74,37.08
  Bottom 0.813: v7.82,24.18 7.82,23.98 9.35,22.45 15.85,22.45 v17.58,24.18
  Bottom 1.016: JP2.13 21.54,53.54 21.54,50.8 20.8,50.06 v20.8,45.01 20.8,42.13 v20.62,41.15 21.03,41.15 23.16,39.01 25.81,39.01 v27.74,37.08 | v14.83,36.37 10.26,36.37 6.3,36.37 3.66,33.73 v3.66,26.11 | 3.66,26.01 5.49,24.18 v7.82,24.18
  Bottom 1.27: v3.66,26.11 3.66,26.01
  pour Top (rank 2): 10.26,50.29 10.26,30.68 39.01,30.68 39.01,50.29
  pour Top (rank 2, hatched): 24.49,36.27 24.49,7.42 60.15,7.42 60.15,36.27
WAKEUP  (via drill 0.41)
  Top 0.254: IC2.14 17.9,45.91 18.69,45.11 19.61,45.11 20.93,46.43 24.99,46.43 v26.11,47.75
  Bottom 0.254: JP2.9 31.7,53.54 31.7,50.7 28.55,47.55 26.31,47.55 v26.11,47.75
XI32
  Top 0.254: IC2.4 22.9,49.32 23.57,49.99 32.51,49.99 40.71,41.79 Q1.P$1 44,41.66 C17.1
XO32
  Top 0.254: IC2.3 23.4,49 23.88,49.48 32.31,49.48 42.5,39.29 Q1.P$2 43.95,39.37 C16.1
XTAL3
  Top 0.254: IC2.5 22.4,49.63 23.27,50.49 36.37,50.49 39.12,47.75 39.73,47.75 | 39.73,47.75 39.83,47.14 X1.2 41.34,46.77 C10.1 | 39.73,47.75 39.56,47.41
XTAL4
  Top 0.254: IC2.6 21.9,50.04 23.06,51.21 37.08,51.21 40.13,48.26 47.45,48.26 48.06,47.55 48.21,47.14 X1.1 51.73,46.32 C11.1
(copper drawn outside any net)
  shapes: Bottom circle x4

### Text on the board
tPlace: 18 | 1 | ALFAT-OEM 1.4 | www.GHIElectronics.com | 10 | 9 | + | 2 | 1 | GHI Elec. | + | +